# Altium schematic sheet NCV1117STAT3G.SchDoc
size A4; SheetNumber: 4; SheetTotal: 4
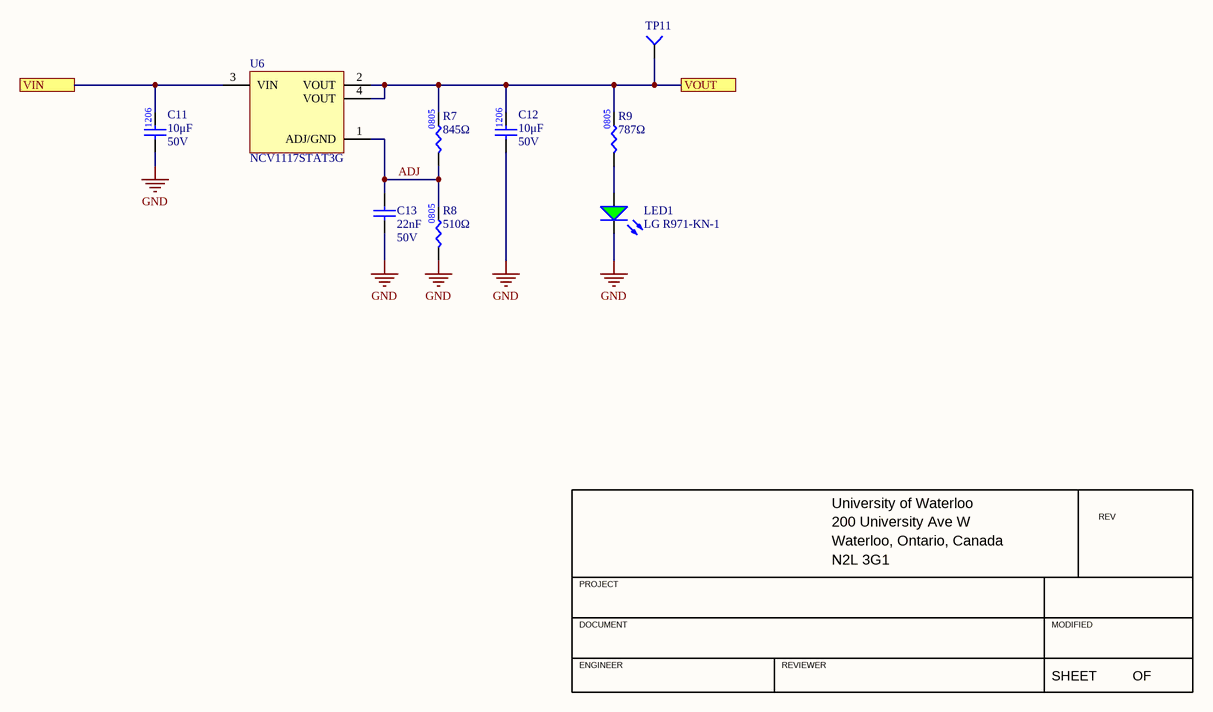
[diagram p0: NCV1117STAT3G.SchDoc]

## Parts
C11  value 10μF  Voltage Rating: 50V  [CAP1206]  (hidden comment: CAP_10uF_50V_1206)
C12  value 10μF  Voltage Rating: 50V  [CAP1206]  (hidden comment: CAP_10uF_50V_1206)
C13  value 22nF  Voltage Rating: 50V  [CAP0805]  (hidden comment: CAP_0.022uF_50V_0805)
LED1  Manufacturer Part Number 1: LG R971-KN-1  [LED_0805_GREEN]  (hidden comment: LED_GREEN)
R7  value 845Ω  [RES0805]  (hidden comment: RES_845Ω_0805_1%)
R8  value 510Ω  [RES0805]  (hidden comment: RES_510Ω_0805_1%)
R9  value 787Ω  [RES0805]  (hidden comment: RES_787Ω_0805_1%)
TP11  TESTPOINT_SMD_LOOP  [S1751-46R]  (value not drawn)
U6  Manufacturer Part Number 1: NCV1117STAT3G  [SOT223]  (hidden comment: LDO_ADJ_1A)

## Ports
VIN (see Top[2A]), VOUT (see Top[3A])

## Nets
GND: C11.1 C12.1 C13.1 LED1.2(K) R8.1
ADJ: C13.2 R7.1 R8.2 U6.1(ADJ/GND)
VIN: C11.2 U6.3(VIN) ; port VIN
VOUT: C12.2 R7.2 R9.2 TP11.1(=value) U6.2(VOUT) U6.4(VOUT) ; port VOUT
NetLED1_1: LED1.1(A) R9.1

## Notes on the sheet
- University of Waterloo
- 200 University Ave W
- REV
- PROJECT
- Waterloo, Ontario, Canada
- N2L 3G1
- DOCUMENT
- ENGINEER
- REVIEWER
- MODIFIED
- SHEET
- OF
- (in symbol RES_510Ω_0805_1%) 0805

## Library data of the parts
C11 C12 = CAP_10uF_50V_1206: CAP CER 10UF 50V X5R 1206; Manufacturer 1: Murata; Manufacturer Part Number 1: GRT31CR61H106KE01L; Supplier Part Number 1: 490-12456-1-ND; Supplier 1: Digi-Key; Mounting Type: SMD; Package: 1206; Dielectric: X5R
C13 = CAP_0.022uF_50V_0805: CAP CER 0.022UF 50V C0G 0805; Manufacturer 1: TDK Corporation; Manufacturer Part Number 1: CGA4J2C0G1H223J125AA; Package/Footprint: 2012; Mounting Type: SMD; Supplier 1: Digi-Key; Supplier Part Number 1: 445-6949-1-ND; LCSC Part #: C1729; Dielectric: C0G
LED1 = LED_GREEN: LED GREEN DIFFUSED 0805 SMD; Manufacturer 1: OSRAM; Forward Voltage Drop: 2.2V; Package/Footprint: 0805; Supplier Part Number 1: 475-1410-1-ND; Supplier 1: Digi-Key; Mounting Type: SMD
R7 = RES_845Ω_0805_1%: RES 845 OHM 1% 1/8W 0805; Manufacturer Part Number 1: RC0805FR-07845RL; Manufacturer 1: YAGEO; Power: 0.125W, 1/8W; Supplier 1: Digi-Key; Supplier Part Number 1: 311-845CRCT-ND; Mounting Type: SMD; Package: 0805; Tolerance: 1%
R8 = RES_510Ω_0805_1%: RES 510 OHM 1% 1/8W 0805; Manufacturer 1: Yageo; Manufacturer Part Number 1: RC0805FR-07510RL; Supplier 1: Digi-Key; Supplier Part Number 1: 311-510CRCT-ND
R9 = RES_787Ω_0805_1%: RES 787 OHM 1% 1/8W 0805; Manufacturer 1: Yageo; Manufacturer Part Number 1: RC0805FR-07787RL; Package/Footprint: 0805; Mounting Type: SMD; Supplier 1: Digi-Key; Supplier Part Number 1: 311-787CRCT-ND
TP11 = TESTPOINT_SMD_LOOP: TESTPOINT SMD LOOP; Manufacturer 1: Harwin; Supplier 1: Digi-Key; Manufacturer Part Number 1: S1751-46R; Mounting Type: SMD; Package/Footprint: SMD; Supplier Part Number 1: 952-1478-1-ND
U6 = LDO_ADJ_1A: IC REG LINEAR POS ADJ 1A SOT223; Manufacturer 1: onsemi; Input Voltage (Max): 20V; Output Voltage (Min): 1.25V; Voltage Dropout (Max): 1.2V; Package/Footprint: SOT-223; Output Current: 1A; Operating Temperature: -40°C - 85°C; Mounting Type: SMD; Supplier 1: Digi-Key; Supplier Part Number 1: NCV1117STAT3GOSCT-ND